# Altium schematic sheet Sheet1.SchDoc
size A2; SheetNumber: 1; SheetTotal: 1
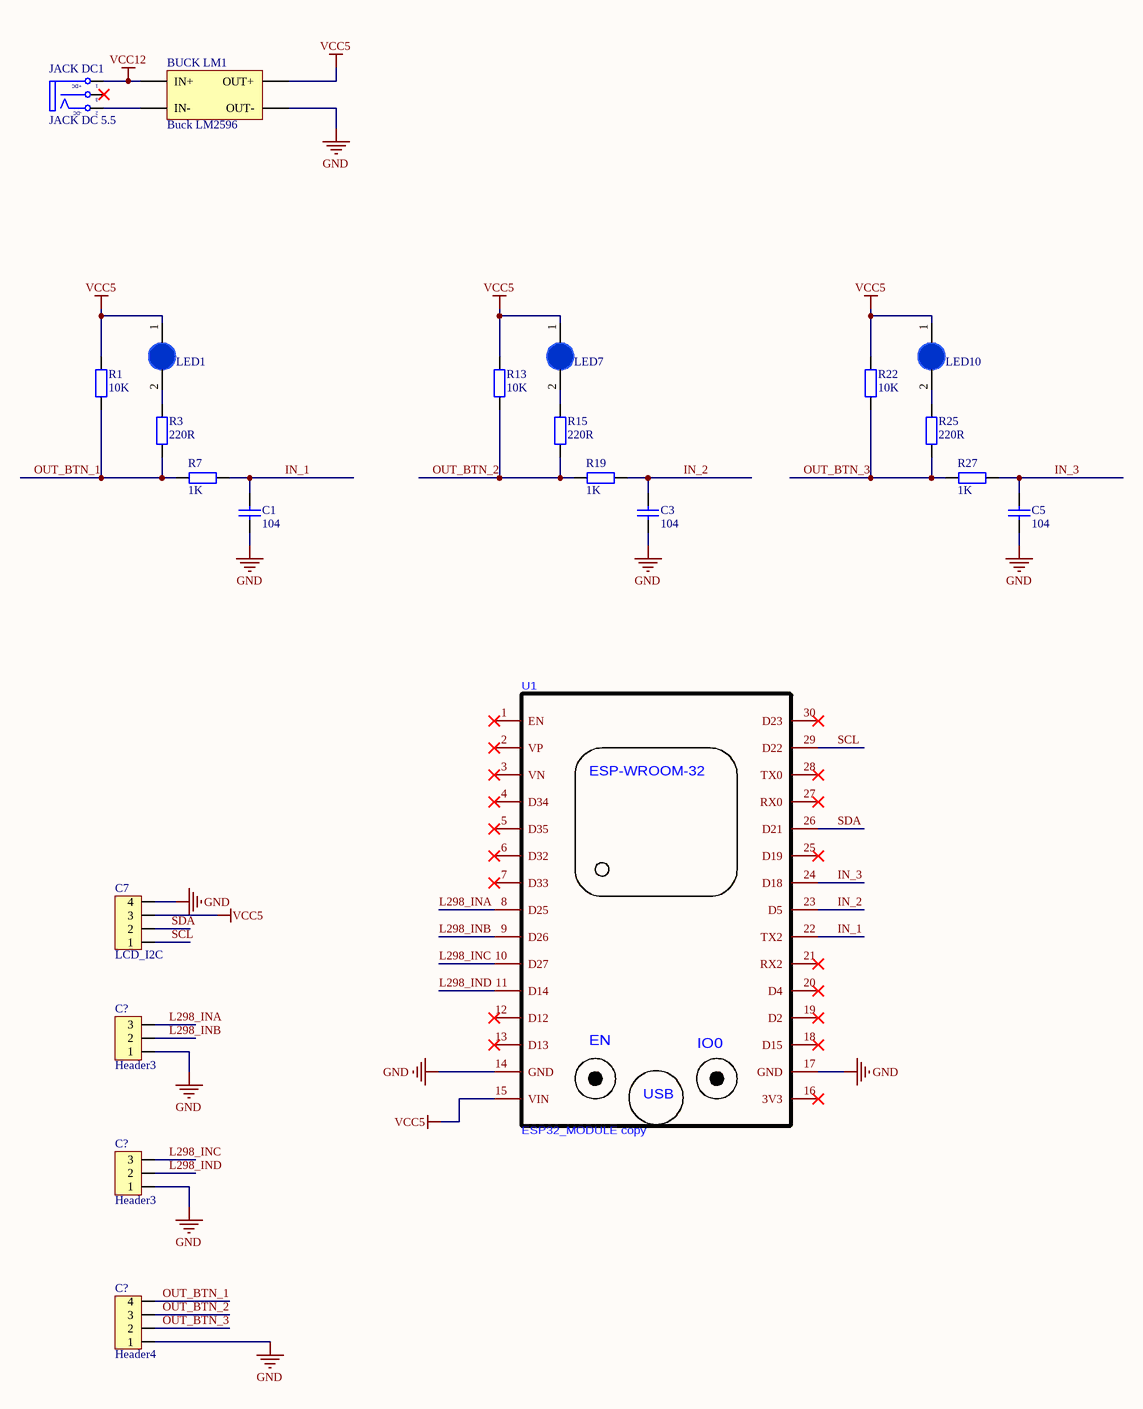
[diagram p0: Sheet1.SchDoc]

## Parts
(Parts that share a designator on the sheet are numbered #1, #2 ... from top to bottom, then left to right.)
BUCK_LM1  Buck LM2596  [BUCK LM2596]
C1  104  [tu gom]
C3  104  [tu gom]
C5  104  [tu gom]
C7  LCD_I2C  [Header4]
C?#1  Header3  [Header3]
C?#2  Header3  [Header3]
C?#3  Header4  [HDR4]
JACK_DC1  JACK DC 5.5  [JACK DC 5.5]
LED1  LED 3mm  [LED-3MM-BLUE]  (value not drawn)
LED7  LED 3mm  [LED-3MM-BLUE]  (value not drawn)
LED10  LED 3mm  [LED-3MM-BLUE]  (value not drawn)
R1  10K  [R1/4W]
R3  220R  [R1/4W]
R7  1K  [R1/4W]
R13  10K  [R1/4W]
R15  220R  [R1/4W]
R19  1K  [R1/4W]
R22  10K  [R1/4W]
R25  220R  [R1/4W]
R27  1K  [R1/4W]
U1  ESP32_MODULE copy  [ESP32-WIFIMODULE-FOOTPRINT]

## Nets
GND: BUCK_LM1.3(OUT-) C1.2 C3.2 C5.2 C7.4 C?#1.1 C?#2.1 C?#3.1 U1.14(GND) U1.17(GND)
VCC5: BUCK_LM1.4(OUT+) C7.3 LED1.1(A) LED7.1(A) LED10.1(A) R1.2 R13.2 R22.2 U1.15(VIN)
VCC12: BUCK_LM1.1(IN+) JACK_DC1.1(T)
IN_1: C1.1 R7.1 U1.22(TX2)
IN_2: C3.1 R19.1 U1.23(D5)
IN_3: C5.1 R27.1 U1.24(D18)
L298_INA: C?#1.3 U1.8(D25)
L298_INB: C?#1.2 U1.9(D26)
L298_INC: C?#2.3 U1.10(D27)
L298_IND: C?#2.2 U1.11(D14)
OUT_BTN_1: C?#3.4 R1.1 R3.1 R7.2
OUT_BTN_2: C?#3.3 R13.1 R15.1 R19.2
OUT_BTN_3: C?#3.2 R22.1 R25.1 R27.2
SCL: C7.1 U1.29(D22)
SDA: C7.2 U1.26(D21)
NetBUCK_LM1_2: BUCK_LM1.2(IN-) JACK_DC1.2(TN)
NetLED1_2: LED1.2(K) R3.2
NetLED7_2: LED7.2(K) R15.2
NetLED10_2: LED10.2(K) R25.2

Not connected (* = marked no-connect by the designer): JACK_DC1 3(S)*; U1 1(EN)* 2(VP)* 3(VN)* 4(D34)* 5(D35)* 6(D32)* 7(D33)* 12(D12)* 13(D13)* 16(3V3)* 18(D15)* 19(D2)* 20(D4)* 21(RX2)* 25(D19)* 27(RX0)* 28(TX0)* 30(D23)*

## Notes on the sheet
- (in symbol ESP32_MODULE copy) ESP-WROOM-32; IO0; USB
- (in symbol JACK DC 5.5) +DC; -DC

## Library data of the parts
C1 C3 C5 = Tu gom 104 50V: Cắm; So_Chan: 2; Ten_Linh_Kien: Tụ gốm 104 100nF 50V; Don_Vi: Con; Ma_Hang: MH004761; Chung_Loai: Cắm; Kieu_Chan: *
C7 C?#3 = Header4: Header IDC, 4 x 1 Pin Vertical 2.54mm Pitch (Non-Boxed, Male); Manufacturer: W¨¹rth Elektronik eiSos GmbH; partNo: 613002143121; ComponentLink1 Description: Manufacturer; ComponentLink2 Description: Datasheet; NoPins: 02; Created Date: 29 March 2013; ComponentLink1URL: http://www.we-online.com; ComponentLink2URL: http://katalog.we-online.de/em/datasheet/6130xx143121.pdf; Created by: Karrer Zheng
C?#1 C?#2 = Header3: Header IDC, 3 x 1 Pin Vertical 2.54mm Pitch (Non-Boxed, Male); Manufacturer: W¨¹rth Elektronik eiSos GmbH; partNo: 613002143121; ComponentLink1 Description: Manufacturer; ComponentLink2 Description: Datasheet; NoPins: 02; Created Date: 29 March 2013; ComponentLink1URL: http://www.we-online.com; ComponentLink2URL: http://katalog.we-online.de/em/datasheet/6130xx143121.pdf; Created by: Karrer Zheng
JACK_DC1 = JACK DC 5.5: Value: Jac DC
LED1 LED7 LED10 = LED 3mm Xanh Duong: Cắm; Don_Vi: Con; Ma_Hang: MH009003; Ten_Linh_Kien: LED 3MM Xanh Dương SS (1000c); Ghi_Chu: *; Kieu_Chan: *; Chung_Loai: Cắm
R1 R3 R7 R13 R15 R19 R22 R25 R27 = R1/4W: Resistor 1/4W; Value: R1/4W - 1K